# EAGLE schematic Ammeter (EAGLE 9.6.2)

## Sheet 1 of 3: Current Sense
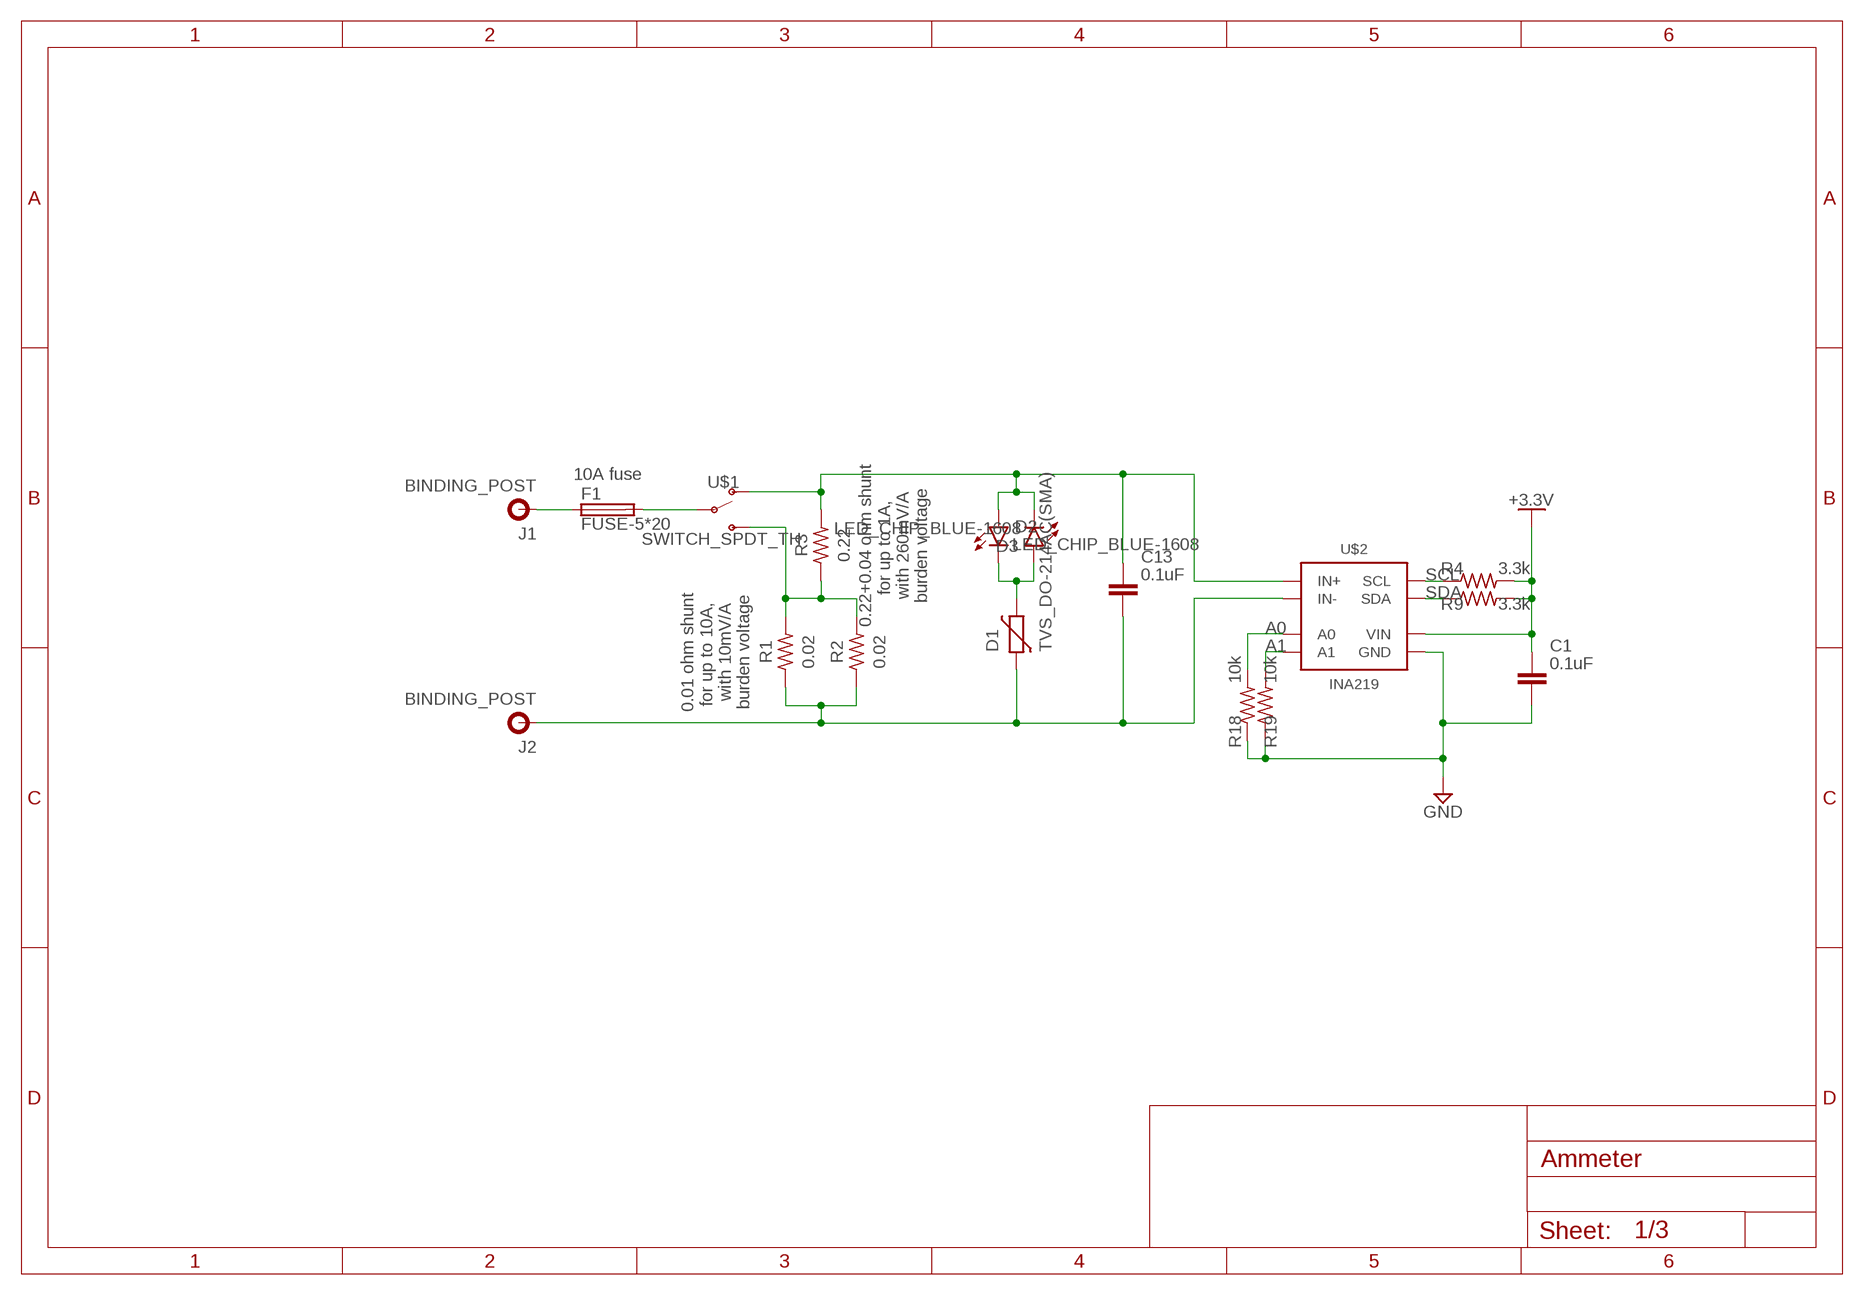
[diagram p0: schematic, sheet 1]

### Parts
C1  0.1uF  C_CHIP-0603(1608-METRIC)  [CAPC1608X85]
C13  0.1uF  C_CHIP-0603(1608-METRIC)  [CAPC1608X85]
D1  TVS_DO-214AC(SMA)  [DIOM5226X290N]
D2  LED_CHIP_BLUE-1608  [LEDC1608X39N_B]
D3  LED_CHIP_BLUE-1608  [LEDC1608X39N_B]
F1  FUSE-5*20  [FUSEHOLDER_"HD"]
J1  BINDING_POST  [BINDING_POST]
J2  BINDING_POST  [BINDING_POST]
R1  0.02  R-US_CHIP-2512(6332-METRIC)  [RESC6332X71]
R2  0.02  R-US_CHIP-2512(6332-METRIC)  [RESC6332X71]
R3  0.22  R-US_CHIP-1210(3225-METRIC)  [RESC3224X71]
R4  3.3k  R-US_CHIP-0603(1608-METRIC)  [RESC1608X60]
R9  3.3k  R-US_CHIP-0603(1608-METRIC)  [RESC1608X60]
R18  10k  R-US_CHIP-0603(1608-METRIC)  [RESC1608X60]
R19  10k  R-US_CHIP-0603(1608-METRIC)  [RESC1608X60]
U$1  SWITCH_SPDT_TH  [SWITCH_SPDT_PTH_11.6X4.0MM_LOCK]
U$2  INA219  [SOT23-8]

### Nets
+3.3V: C1.1 R4.2 R9.2 U$2.P4(VIN) ; also sheet 2,3
A0: R18.2 U$2.P7(A0)
A1: R19.2 U$2.P8(A1)
GND: C1.2 R18.1 R19.1 U$2.P3(GND) ; also sheet 2,3
N$1: R1.2 R2.2 R3.1 U$1.3(S)
N$2: F1.P$1 J1.P$1
N$3: C13.1 D2.1(A) D3.2(C) R3.2 U$1.1(O) U$2.P1(IN+)
N$4: F1.P$2 U$1.2(P)
N$5: D1.2 D2.2(C) D3.1(A)
N$6: C13.2 D1.1 J2.P$1 R1.1 R2.1 U$2.P2(IN-)
SCL: R4.1 U$2.P5(SCL) ; also sheet 3
SDA: R9.1 U$2.P6(SDA) ; also sheet 3

### Notes on the sheet
- 10A fuse
- 0.22+0.04 ohm shunt
  for up to 1A, 
  with 260mV/A
  burden voltage
- 0.01 ohm shunt
  for up to 10A, 
  with 10mV/A
  burden voltage

## Sheet 2 of 3: USB and Power in
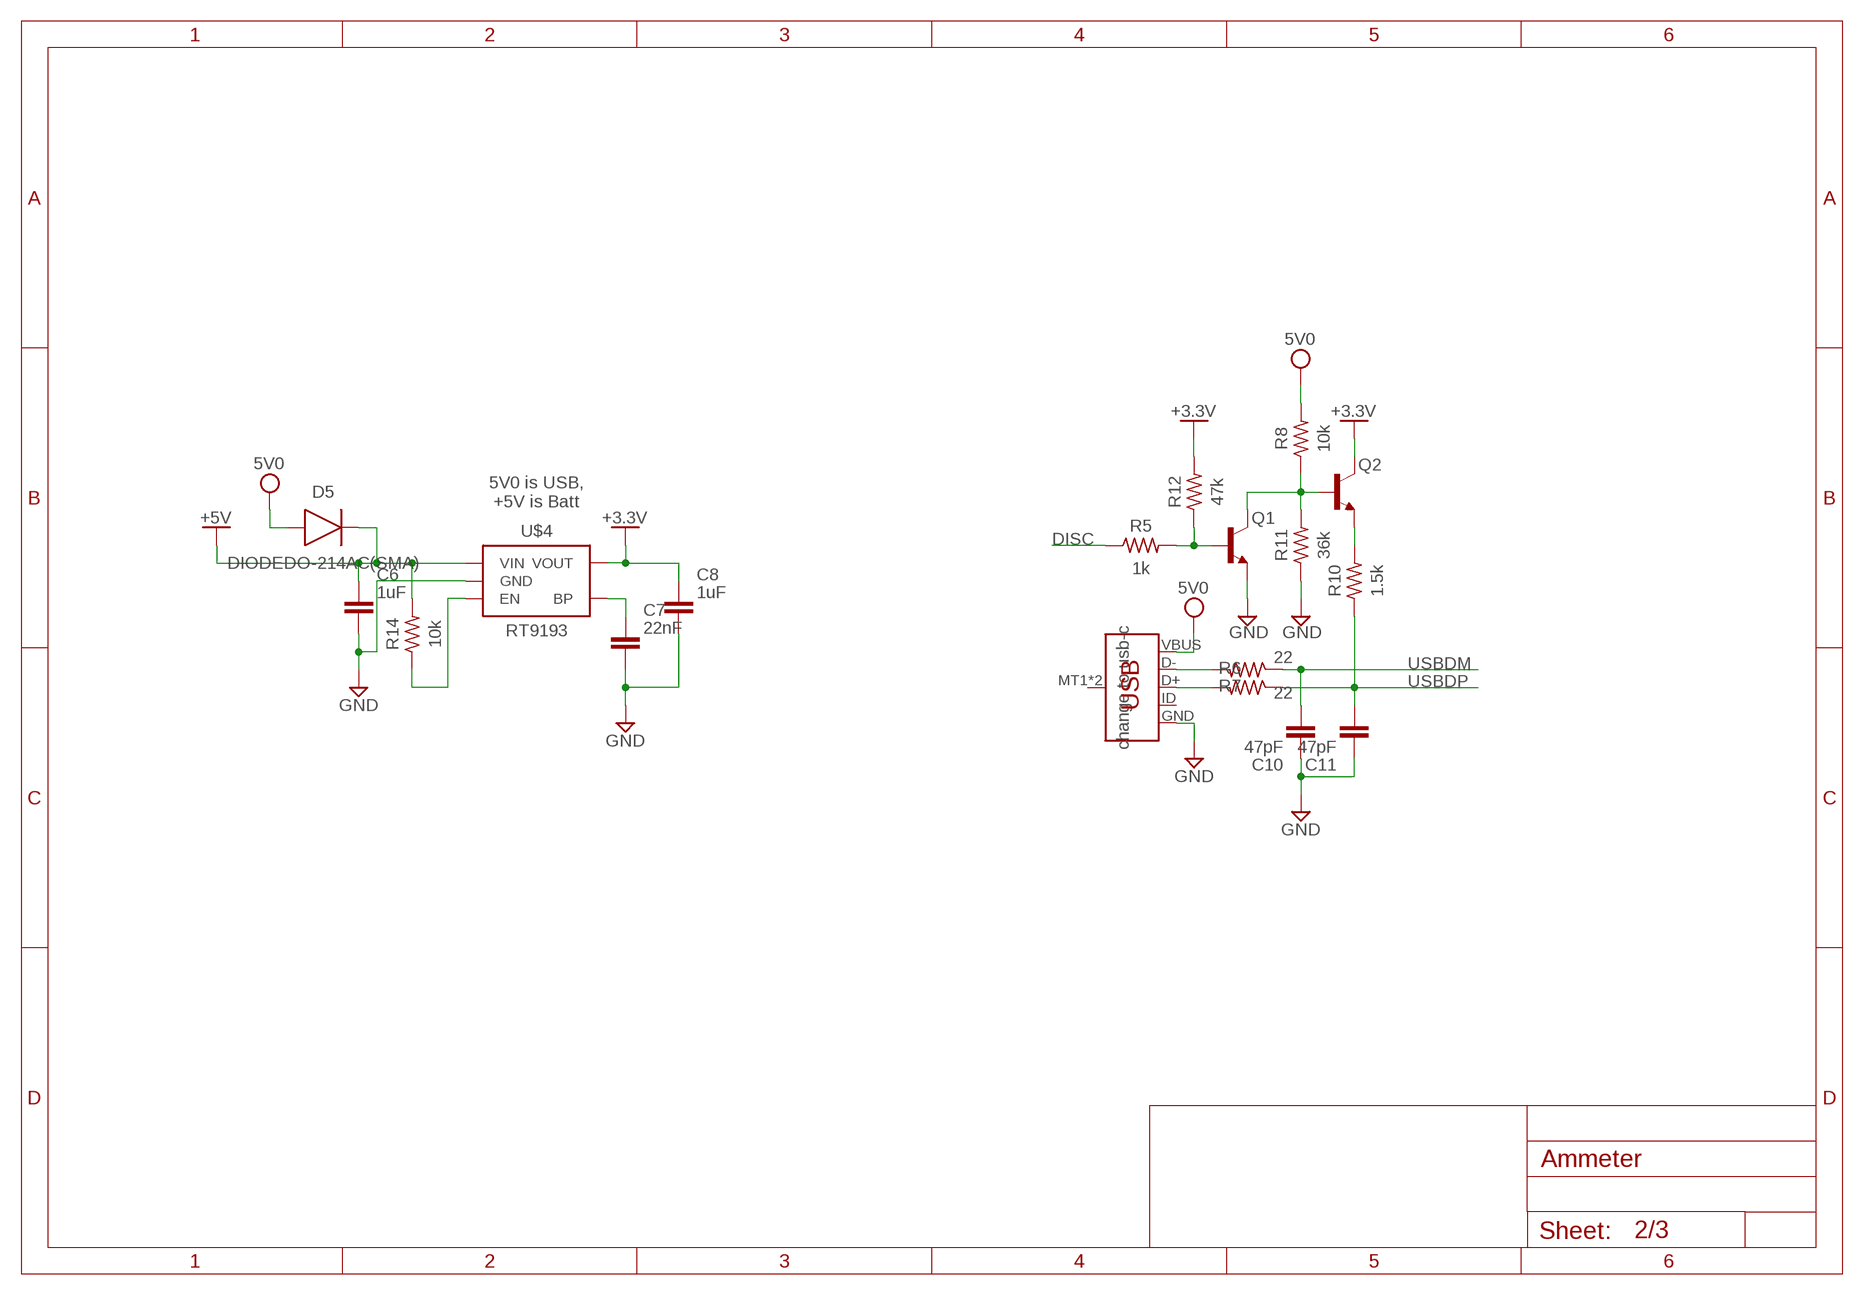
[diagram p1: schematic, sheet 2]

### Parts
C6  1uF  C_CHIP-0603(1608-METRIC)  [CAPC1608X85]
C7  22nF  C_CHIP-0603(1608-METRIC)  [CAPC1608X85]
C8  1uF  C_CHIP-0603(1608-METRIC)  [CAPC1608X85]
C10  47pF  C_CHIP-0603(1608-METRIC)  [CAPC1608X85]
C11  47pF  C_CHIP-0603(1608-METRIC)  [CAPC1608X85]
D5  DIODEDO-214AC(SMA)  [DIOM5226X290N]
Q1  NPN-BJT  NPN_SOT23  [SOT95P237X112-3N]
Q2  NPN-BJT  NPN_SOT23  [SOT95P237X112-3N]
R5  1k  R-US_CHIP-0603(1608-METRIC)  [RESC1608X60]
R6  22  R-US_CHIP-0603(1608-METRIC)  [RESC1608X60]
R7  22  R-US_CHIP-0603(1608-METRIC)  [RESC1608X60]
R8  10k  R-US_CHIP-0603(1608-METRIC)  [RESC1608X60]
R10  1.5k  R-US_CHIP-0603(1608-METRIC)  [RESC1608X60]
R11  36k  R-US_CHIP-0603(1608-METRIC)  [RESC1608X60]
R12  47k  R-US_CHIP-0603(1608-METRIC)  [RESC1608X60]
R14  10k  R-US_CHIP-0603(1608-METRIC)  [RESC1608X60]
U$4  RT9193  [SOT23-5]
X1  USB-MINIB  USB_MICRO-B  [USB-MICROB-CLEANED]

### Nets
5V0: D5.1(A) R8.2 X1.VBUS
+3.3V: C8.1 Q2.3(C) R12.2 U$4.5(VOUT) ; also sheet 1,3
+5V: C6.1 D5.2(C) R14.2 U$4.1(VIN)
DGND: Q1.1(E) R11.1 ; supply symbol labelled GND
DISC: R5.1 ; also sheet 3
GND: C6.2 C7.2 C8.2 C10.1 C11.1 U$4.2(GND) X1.GND ; also sheet 1,3
N$9: R14.1 U$4.3(EN)
N$10: C7.1 U$4.4(BP)
N$51: Q2.1(E) R10.2
N$59: R6.2 X1.D-
N$60: R7.2 X1.D+
N$71: Q1.3(C) Q2.2(B) R8.1 R11.2
N$73: Q1.2(B) R5.2 R12.1
USBDM: C10.2 R6.1 ; also sheet 3
USBDP: C11.2 R7.1 R10.1 ; also sheet 3
Unconnected: X1.ID X1.MT1(SHIELD) X1.MT2(SHIELD)

### Notes on the sheet
- 5V0 is USB,
  +5V is Batt
- change to usb-c

## Sheet 3 of 3: MCU
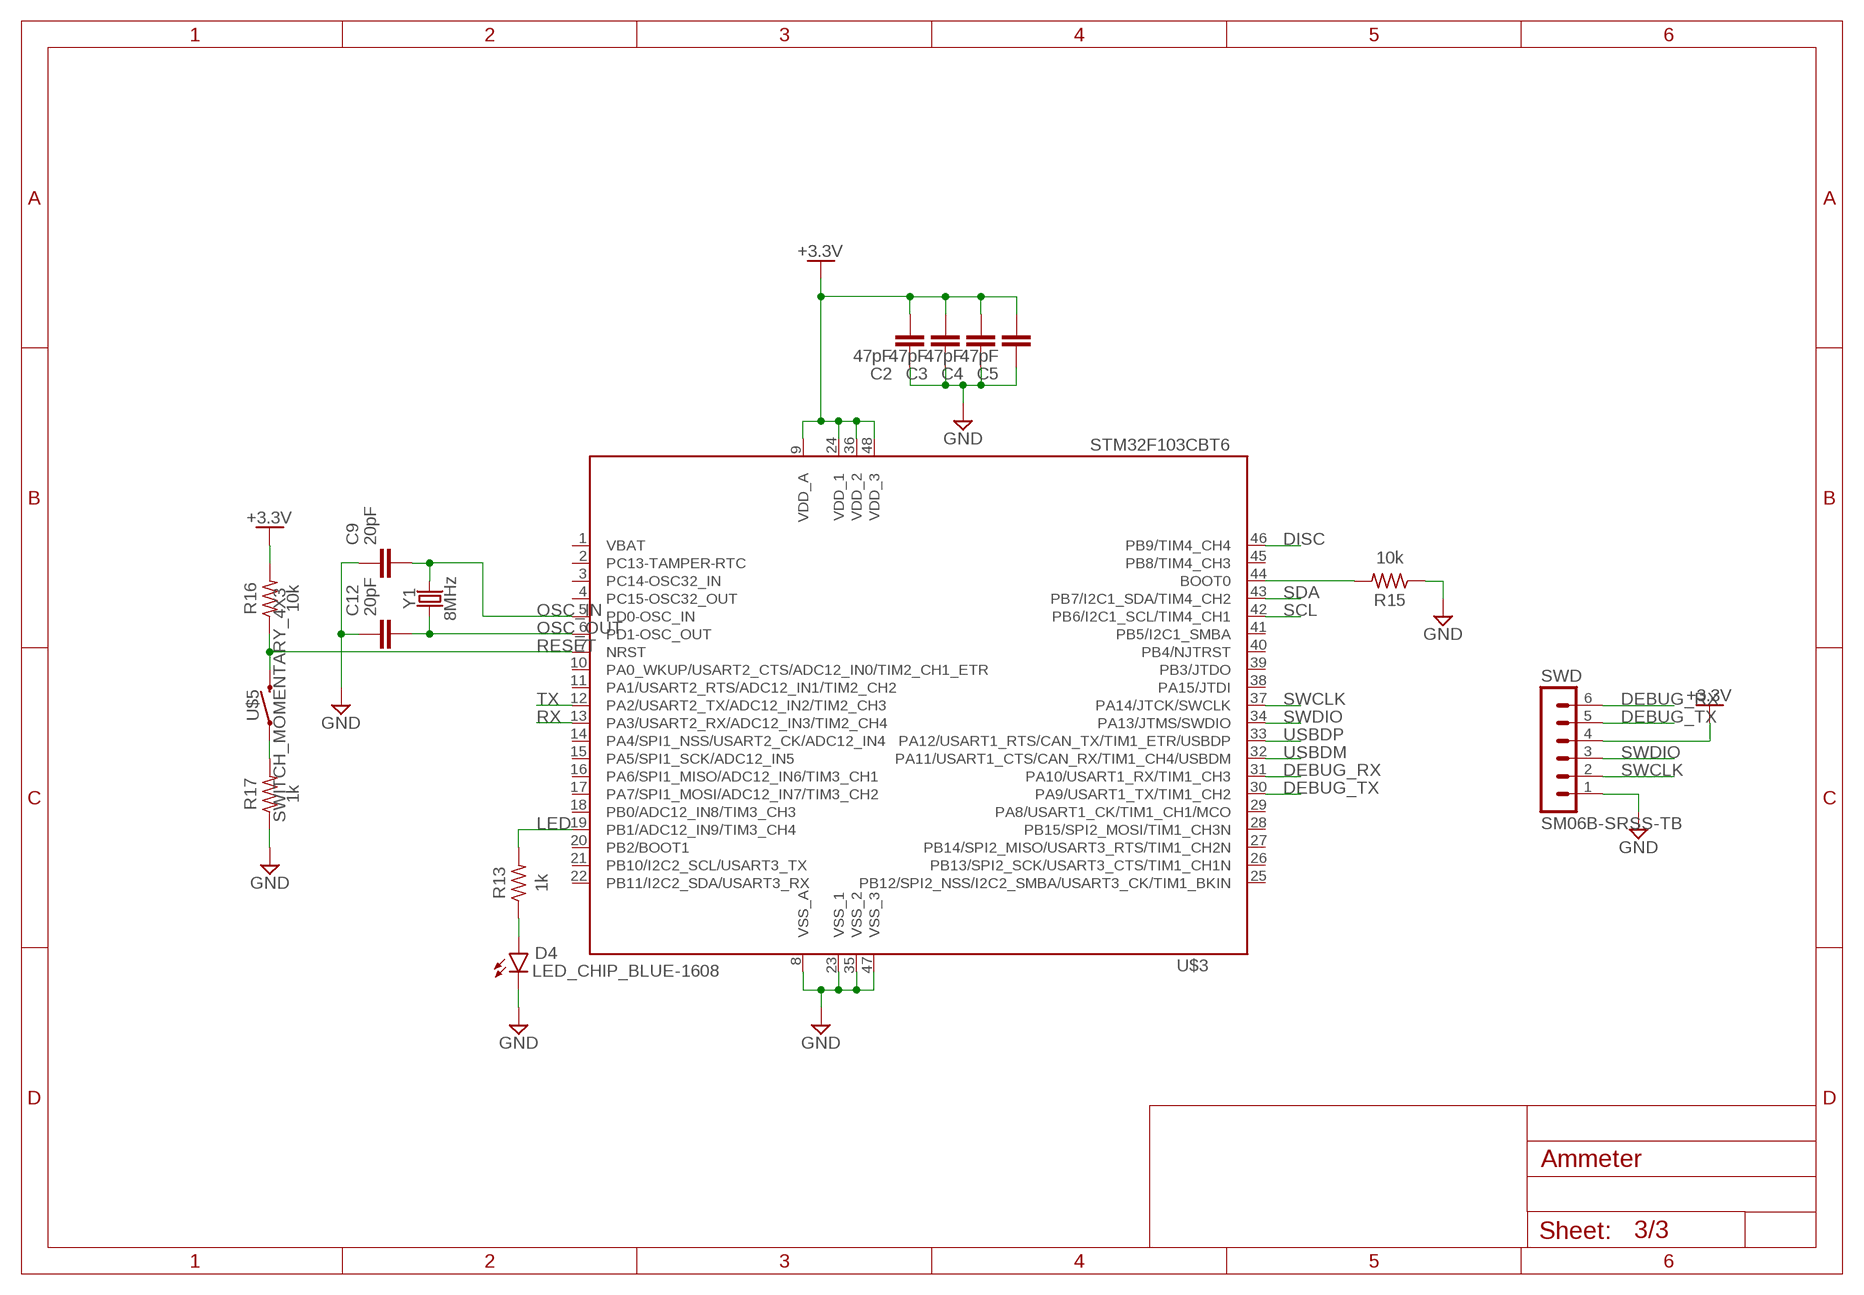
[diagram p2: schematic, sheet 3]

### Parts
C2  47pF  C_CHIP-0603(1608-METRIC)  [CAPC1608X85]
C3  47pF  C_CHIP-0603(1608-METRIC)  [CAPC1608X85]
C4  47pF  C_CHIP-0603(1608-METRIC)  [CAPC1608X85]
C5  47pF  C_CHIP-0603(1608-METRIC)  [CAPC1608X85]
C9  20pF  C_CHIP-0603(1608-METRIC)  [CAPC1608X85]
C12  20pF  C_CHIP-0603(1608-METRIC)  [CAPC1608X85]
D4  LED_CHIP_BLUE-1608  [LEDC1608X39N_B]
R13  1k  R-US_CHIP-0603(1608-METRIC)  [RESC1608X60]
R15  10k  R-US_CHIP-0603(1608-METRIC)  [RESC1608X60]
R16  10k  R-US_CHIP-0603(1608-METRIC)  [RESC1608X60]
R17  1k  R-US_CHIP-0603(1608-METRIC)  [RESC1608X60]
SWD  SM06B-SRSS-TB  [SM06B-SRSS-TB]
U$3  STM32F103CBT6  [LQFP48]
U$5  SWITCH_MOMENTARY_4X3  [MOMENTARY_SWITCH_4X3]
Y1  8MHz  CRYSTAL_5032  [CRYSTAL-SMD-5X3.2-2PAD]

### Nets
+3.3V: C2.2 C3.2 C4.2 C5.2 R16.2 SWD.4 U$3.9(VDD_A) U$3.24(VDD_1) U$3.36(VDD_2) U$3.48(VDD_3) ; also sheet 1,2
DEBUG_RX: SWD.6 U$3.31(PA10/USART1_RX/TIM1_CH3)
DEBUG_TX: SWD.5 U$3.30(PA9/USART1_TX/TIM1_CH2)
DISC: U$3.46(PB9/TIM4_CH4) ; also sheet 2
GND: C2.1 C3.1 C4.1 C5.1 C9.1 C12.1 D4.2(C) R15.1 R17.1 SWD.1 U$3.8(VSS_A) U$3.23(VSS_1) U$3.35(VSS_2) U$3.47(VSS_3) ; also sheet 1,2
LED: R13.2 U$3.19(PB1/ADC12_IN9/TIM3_CH4)
N$7: D4.1(A) R13.1
N$11: R15.2 U$3.44(BOOT0)
N$12: R17.2 U$5.P$1
OSC_IN: C9.2 U$3.5(PD0-OSC_IN) Y1.P$2
OSC_OUT: C12.2 U$3.6(PD1-OSC_OUT) Y1.P$1
RESET: R16.1 U$3.7(NRST) U$5.P$2
RX: U$3.13(PA3/USART2_RX/ADC12_IN3/TIM2_CH4)
SCL: U$3.42(PB6/I2C1_SCL/TIM4_CH1) ; also sheet 1
SDA: U$3.43(PB7/I2C1_SDA/TIM4_CH2) ; also sheet 1
SWCLK: SWD.2 U$3.37(PA14/JTCK/SWCLK)
SWDIO: SWD.3 U$3.34(PA13/JTMS/SWDIO)
TX: U$3.12(PA2/USART2_TX/ADC12_IN2/TIM2_CH3)
USBDM: U$3.32(PA11/USART1_CTS/CAN_RX/TIM1_CH4/USBDM) ; also sheet 2
USBDP: U$3.33(PA12/USART1_RTS/CAN_TX/TIM1_ETR/USBDP) ; also sheet 2
Unconnected: U$3.2(PC13-TAMPER-RTC) U$3.3(PC14-OSC32_IN) U$3.4(PC15-OSC32_OUT) U$3.10(PA0_WKUP/USART2_CTS/ADC12_IN0/TIM2_CH1_ETR) U$3.11(PA1/USART2_RTS/ADC12_IN1/TIM2_CH2) U$3.14(PA4/SPI1_NSS/USART2_CK/ADC12_IN4) U$3.15(PA5/SPI1_SCK/ADC12_IN5) U$3.16(PA6/SPI1_MISO/ADC12_IN6/TIM3_CH1) U$3.17(PA7/SPI1_MOSI/ADC12_IN7/TIM3_CH2) U$3.18(PB0/ADC12_IN8/TIM3_CH3) U$3.20(PB2/BOOT1) U$3.21(PB10/I2C2_SCL/USART3_TX) U$3.22(PB11/I2C2_SDA/USART3_RX) U$3.25(PB12/SPI2_NSS/I2C2_SMBA/USART3_CK/TIM1_BKIN) U$3.26(PB13/SPI2_SCK/USART3_CTS/TIM1_CH1N) U$3.27(PB14/SPI2_MISO/USART3_RTS/TIM1_CH2N) U$3.28(PB15/SPI2_MOSI/TIM1_CH3N) U$3.29(PA8/USART1_CK/TIM1_CH1/MCO) U$3.38(PA15/JTDI) U$3.39(PB3/JTDO) U$3.40(PB4/NJTRST) U$3.41(PB5/I2C1_SMBA) U$3.45(PB8/TIM4_CH3)

## Power pins joined to a net without a drawn wire
VBAT: U$3.1(VBAT)

## Library data of the parts
C1-C13 = Capacitor:C: Capacitor - Generic; CATEGORY: Capacitor
D1 = Circuit-Protection:TVS: TVS Diode - Generic; CATEGORY: Circuit-Protection; SUB-CATEGORY: TVS-Diode
D2-D4 = Opto-Electronic:LED_CHIP: LED - Generic; CATEGORY: Opto-Electronic; COLOR: Blue; SUB-CATEGORY: LED
D5 = Diode:DIODE: Diode Rectifier - Generic; CATEGORY: Diode; SUB-CATEGORY: Rectifier
F1 = JH:FUSE
J1 J2 = Connectors:BINDING_POST: Binding Post The component itself has an threaded, insulated body that goes through the board, with a small threaded metal stud coming off the back. The intent of this package is that the post goes through a milled obling hole, and a small wire would be used to connect from the PCB pad to the metal contact on the post. SparkFun Products: SparkFun Decade Resistance Box <https://www.sparkfun.com/products/13006> SparkFun Benchtop Power Board Kit <https://www.sparkfun.com/products/12867> Binding Post - Red <https://www.sparkfun.com/products/9739> Binding Post - Black <https://www.sparkfun.com/products/9740>; PROD_ID: CONN-09675; SF_ID: PRT-09740
Q1 Q2 = Transistor:NPN: NPN - Generic; CATEGORY: Transistor; SUB-CATEGORY: BJT; TYPE: NPN
R1-R19 = Resistor:R-US: Resistor Fixed - ANSI; CATEGORY: Resistor; SUB-CATEGORY: Fixed
SWD = con-JST SH:SM06B-SRSS: JST SH series header 1.00mm pitch disconnectable crimp style connectors, horizontal (side entry type), 6 pins
U$1 = JH:SWITCH_SPDT
U$2 = JH:INA219
U$3 = JH:STM32F103CBT6
U$4 = JH:RT9193
U$5 = JH:SWITCH_MOMENTARY
X1 = Connectors:USB_MICRO-B: USB Type Micro-B Connector Male/female and PTH/SMT variants SparkFun Products: SparkFun microB USB Breakout <https://www.sparkfun.com/products/12035> SparkFun USB microB Plug Breakout <https://www.sparkfun.com/products/10031> SparkFun ESP8266 Thing <https://www.sparkfun.com/products/13231>
Y1 = JH:CRYSTAL: Crystals (Generic) These are passive quartz crystals, which can be used as a clock source for a microcontroller. Crystal's are two-terminal devices. They require external "load" capacitors to generate an oscillating signal.